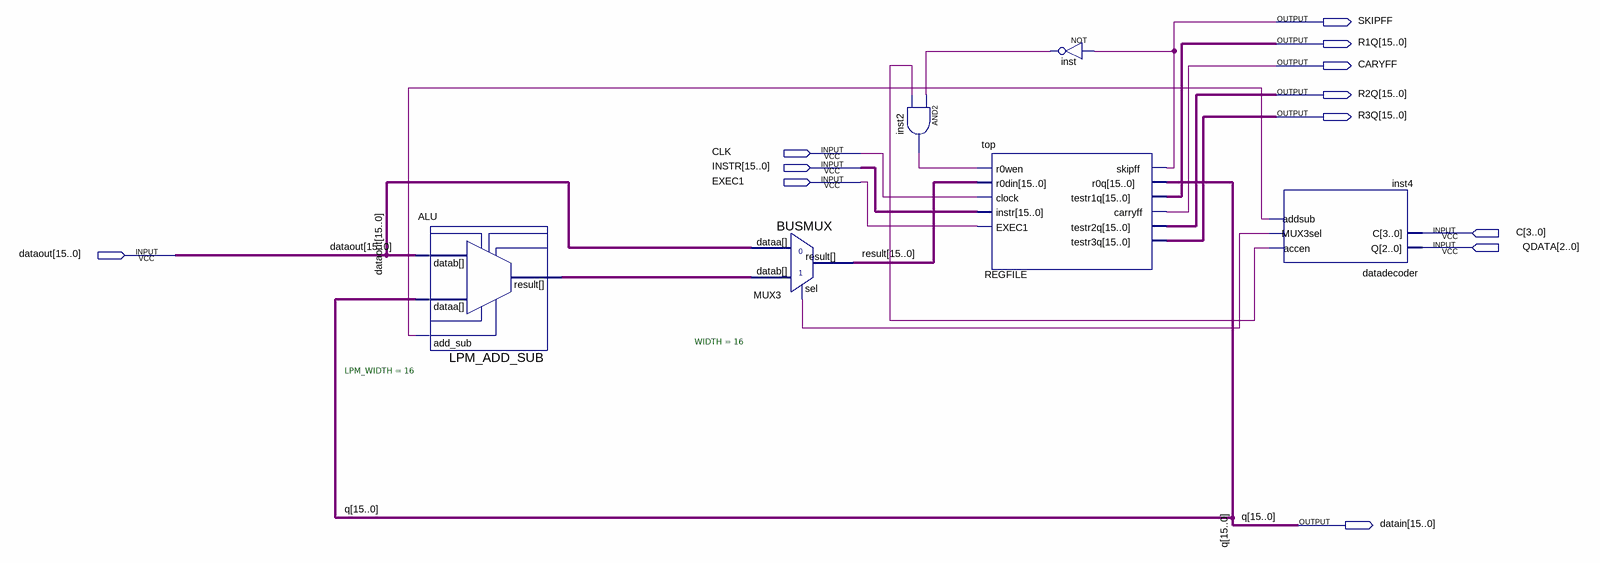
[diagram p0: schematic sheet]
// Quartus schematic Datapath.bdf as structural Verilog: 6 symbols, 12 pins
module Datapath (
  input  CLK,
  input  [15:0] INSTR,
  input  EXEC1,
  input  [3:0] C,
  input  [2:0] QDATA,
  input  [15:0] dataout,
  output SKIPFF,
  output [15:0] R1Q,
  output CARYFF,
  output [15:0] R2Q,
  output [15:0] R3Q,
  output [15:0] datain
);

  wire inst2_out, inst4_accen, inst4_addsub, inst4_mux3sel, inst_out;
  wire [15:0] ALU_result, result;

  LPM_ADD_SUB #(.LPM_WIDTH(16)) ALU (.add_sub(inst4_addsub), .dataa(datain), .datab(dataout), .result(ALU_result));
  BUSMUX #(.WIDTH(16)) MUX3 (.datab(ALU_result), .sel(inst4_mux3sel), .dataa(dataout), .result(result));
  and inst2 (inst2_out, inst_out, inst4_accen);
  top REGFILE (
    .r0wen(inst2_out), .r0din(result), .clock(CLK), .instr(INSTR), .EXEC1(EXEC1), .skipff(SKIPFF),
    .r0q(datain), .testr1q(R1Q), .carryff(CARYFF), .testr2q(R2Q), .testr3q(R3Q));
  not inst (inst_out, SKIPFF);
  datadecoder inst4 (.Q(QDATA), .C(C), .accen(inst4_accen), .MUX3sel(inst4_mux3sel), .addsub(inst4_addsub));

  // Other names for the same wires on the sheet: q[15:0] = datain
endmodule
